# EAGLE design videopac_cart_V1.1 display addonbrd (EAGLE 7.5.0)
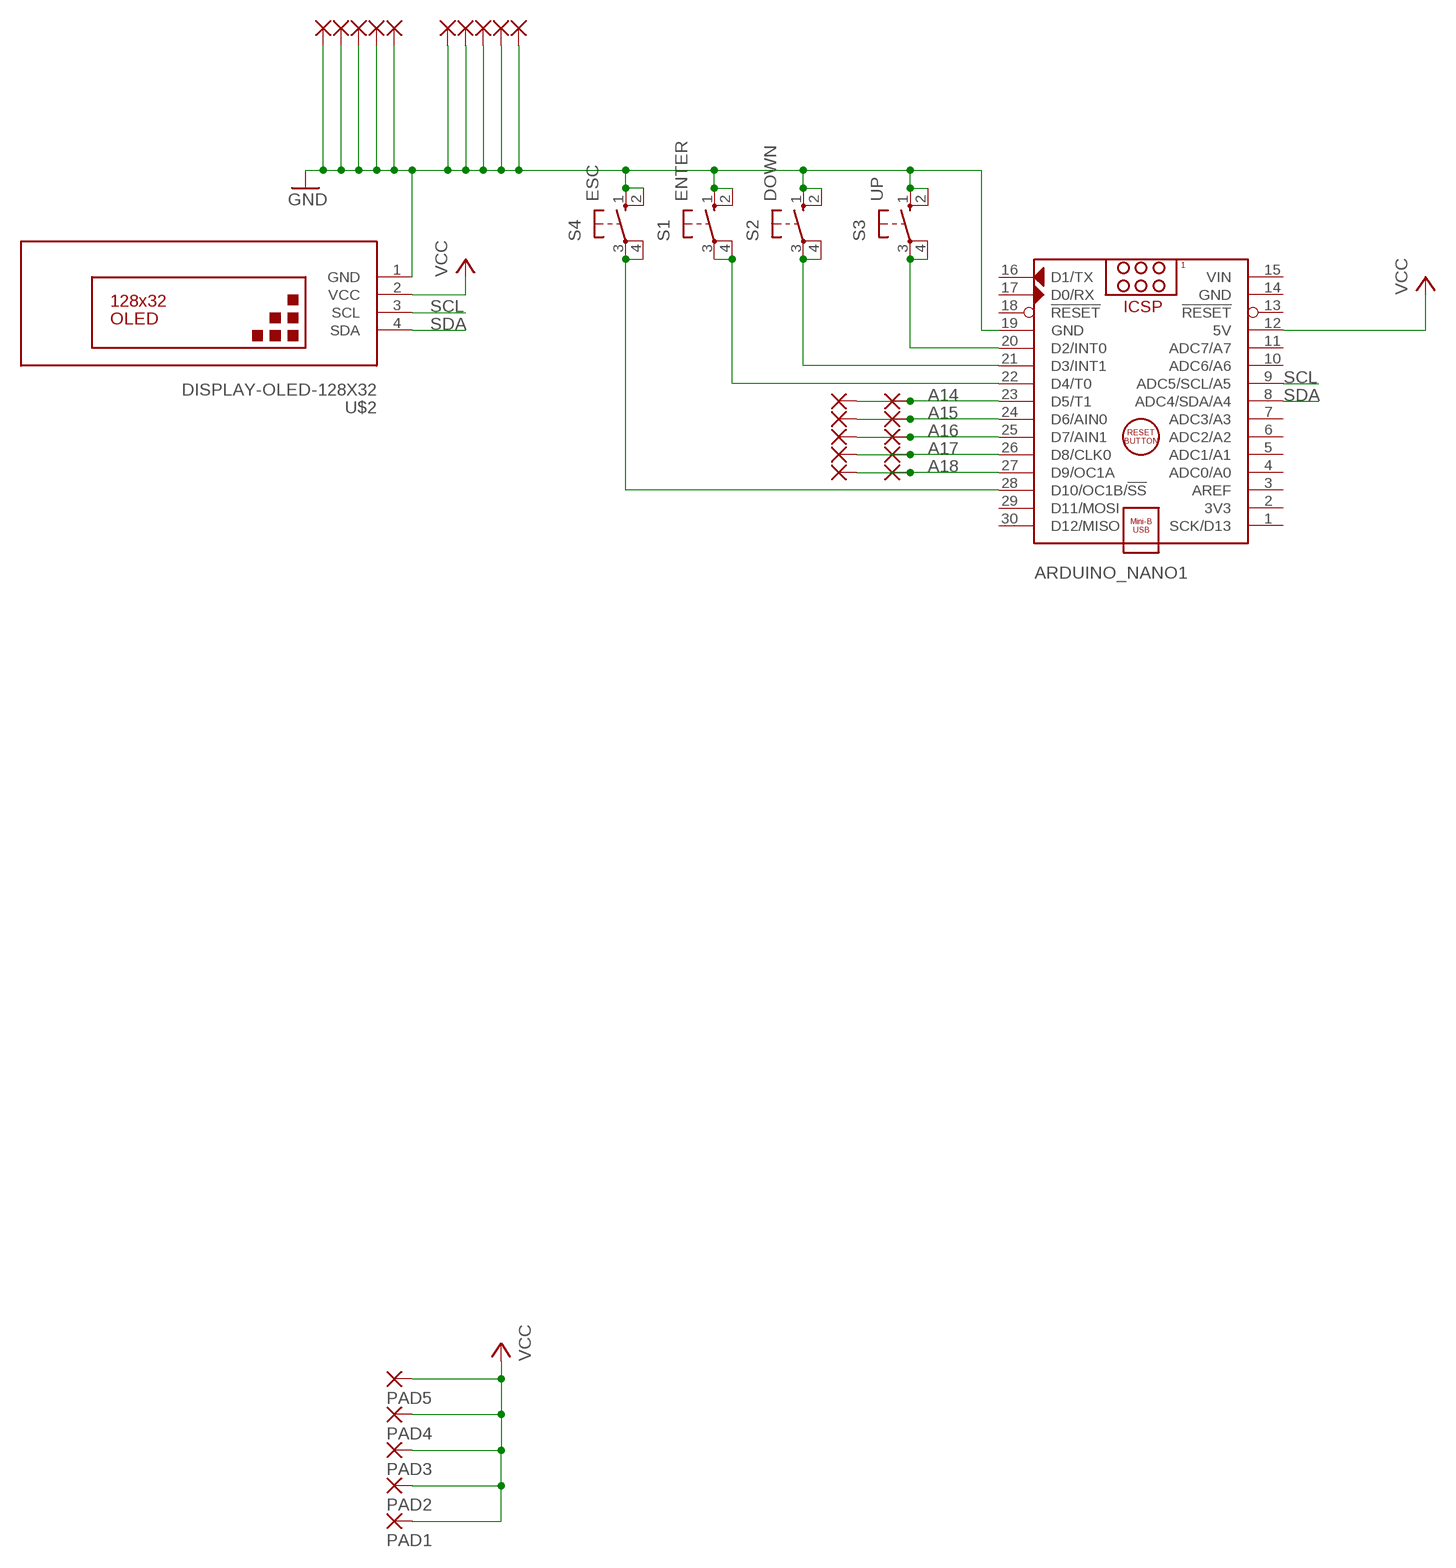
[diagram p0: schematic, sheet 1]

## Parts
ARDUINO_NANO1  ARDUINO_NANO  [ARDUINO_NANO]
PAD1  1,6/0,9  [1,6/0,9]
PAD2  1,6/0,9  [1,6/0,9]
PAD3  1,6/0,9  [1,6/0,9]
PAD4  1,6/0,9  [1,6/0,9]
PAD5  1,6/0,9  [1,6/0,9]
PAD6  1,6/0,9  [1,6/0,9]
PAD7  1,6/0,9  [1,6/0,9]
PAD8  1,6/0,9  [1,6/0,9]
PAD9  1,6/0,9  [1,6/0,9]
PAD10  1,6/0,9  [1,6/0,9]
PAD11  1,6/0,9  [1,6/0,9]
PAD12  1,6/0,9  [1,6/0,9]
PAD13  1,6/0,9  [1,6/0,9]
PAD14  1,6/0,9  [1,6/0,9]
PAD15  1,6/0,9  [1,6/0,9]
PAD16  1,6/0,9  [1,6/0,9]
PAD17  1,6/0,9  [1,6/0,9]
PAD18  1,6/0,9  [1,6/0,9]
PAD19  1,6/0,9  [1,6/0,9]
PAD20  1,6/0,9  [1,6/0,9]
PAD21  1,6/0,9  [1,6/0,9]
PAD22  1,6/0,9  [1,6/0,9]
PAD23  1,6/0,9  [1,6/0,9]
PAD24  1,6/0,9  [1,6/0,9]
PAD25  1,6/0,9  [1,6/0,9]
S1  ENTER  10-XX  [B3F-10XX]
S2  DOWN  10-XX  [B3F-10XX]
S3  UP  10-XX  [B3F-10XX]
S4  ESC  10-XX  [B3F-10XX]
U$2  DISPLAY-OLED-128X32  [DISPLAY-OLED-128X32]

## Nets
A14: ARDUINO_NANO1.23(D5/T1) PAD6.1(P) PAD11.1(P)
A15: ARDUINO_NANO1.24(D6/AIN0) PAD7.1(P) PAD12.1(P)
A16: ARDUINO_NANO1.25(D7/AIN1) PAD8.1(P) PAD13.1(P)
A17: ARDUINO_NANO1.26(D8/CLK0) PAD9.1(P) PAD14.1(P)
A18: ARDUINO_NANO1.27(D9/OC1A) PAD10.1(P) PAD15.1(P)
GND [power]: ARDUINO_NANO1.19(GND) PAD16.1(P) PAD17.1(P) PAD18.1(P) PAD19.1(P) PAD20.1(P) PAD21.1(P) PAD22.1(P) PAD23.1(P) PAD24.1(P) PAD25.1(P) S1.1(S) S1.2(S1) S2.1(S) S2.2(S1) S3.1(S) S3.2(S1) S4.1(S) S4.2(S1) U$2.1(GND)
N$1: ARDUINO_NANO1.28(D10/OC1B/!SS) S4.3(P) S4.4(P1)
N$31: ARDUINO_NANO1.20(D2/INT0) S3.3(P) S3.4(P1)
N$32: ARDUINO_NANO1.21(D3/INT1) S2.3(P) S2.4(P1)
N$33: ARDUINO_NANO1.22(D4/T0) S1.3(P) S1.4(P1)
SCL: ARDUINO_NANO1.9(ADC5/SCL/A5) U$2.3(SCL)
SDA: ARDUINO_NANO1.8(ADC4/SDA/A4) U$2.4(SDA)
VCC [power]: ARDUINO_NANO1.12(5V) PAD1.1(P) PAD2.1(P) PAD3.1(P) PAD4.1(P) PAD5.1(P) U$2.2(VCC)
Unconnected: ARDUINO_NANO1.1(SCK/D13) ARDUINO_NANO1.2(3V3) ARDUINO_NANO1.3(AREF) ARDUINO_NANO1.4(ADC0/A0) ARDUINO_NANO1.5(ADC1/A1) ARDUINO_NANO1.6(ADC2/A2) ARDUINO_NANO1.7(ADC3/A3) ARDUINO_NANO1.10(ADC6/A6) ARDUINO_NANO1.11(ADC7/A7) ARDUINO_NANO1.13(!RESET) ARDUINO_NANO1.16(D1/TX) ARDUINO_NANO1.17(D0/RX) ARDUINO_NANO1.18(!RESET) ARDUINO_NANO1.29(D11/MOSI) ARDUINO_NANO1.30(D12/MISO)

## Power pins joined to a net without a drawn wire
GND: ARDUINO_NANO1.14(GND)
VIN: ARDUINO_NANO1.15(VIN)

## Library data of the parts
ARDUINO_NANO1 = ArduinoNanoV30:ARDUINO_NANO: Arduino Nano V3.0 Module Overview: The Arduino Nano is a small, complete, and breadboard-friendly board based on the ATmega328 (Arduino Nano 3.x) or ATmega168 (Arduino Nano 2.x). It has more or less the same functionality of the Arduino Duemilanove, but in a different package. It lacks only a DC power jack, and works with a Mini-B USB cable instead of a standard one. The Nano was designed and is being produced by Gravitech <http://www.gravitech.us/arna30wiatp.html>. General specifications: Item Value Microcontroller Atmel ATmega168 or ATmega328 Operating Voltage (logic level) 5 V Input Voltage (recommended) 7-12 V Input Voltage (limits) 6-20 V Digital I/O Pins 14 (of which 6 provide PWM output) Analog Input Pins 8 DC Current per I/O Pin 40 mA Flash Memory 16 KB (ATmega168) or 32 KB (ATmega328) of which 2 KB used by bootloader SRAM 1 KB (ATmega168) or 2 KB (ATmega328) EEPROM 512 bytes (ATmega168) or 1 KB (ATmega328) Clock Speed 16 MHz Dimensions (Inches) 0.73" x 1.70" Dimensions (mm) 18mm x 45mm Overall height About 9 mm (not including pins) Weigth 5 g Power: The Arduino Nano can be powered via the Mini-B USB connection, 6-20V unregulated external power supply (pin 30), or 5V regulated external power supply (pin 27). The power source is automatically selected to the highest voltage source. Memory: The ATmega168 has 16 KB of flash memory for storing code (of which 2 KB is used for the bootloader); the ATmega328 has 32 KB, (also with 2 KB used for the bootloader). The ATmega168 has 1 KB of SRAM and 512 bytes of EEPROM (which can be read and written with the EEPROM library); the ATmega328 has 2 KB of SRAM and 1 KB of EEPROM. Input and Output: Each of the 14 digital pins on the Nano can be used as an input or output, using pinMode(), digitalWrite(), and digitalRead() functions. They operate at 5 volts. Each pin can provide or receive a maximum of 40 mA and has an internal pull-up resistor (disconnected by default) of 20-50 kOhms. In addition, some pins have specialized functions. Visit Arduino - ArduinoBoardNano <https://www.arduino.cc/en/Main/ArduinoBoardNano>
PAD1-PAD25 = wirepad:1,6/0,9: THROUGH-HOLE PAD
S1-S4 = switch-omron:10-XX: OMRON SWITCH; MPN: B3F-1000; OC_FARNELL: 176432; OC_NEWARK: 36M3542
U$2 = diy-modules:DISPLAY-OLED-128X32: 128x32 Dot Matrix OLED Module with I2C interface based on SSD1306 chip More details available here: http://www.tinyosshop.com/index.php?route=product/product&product_id=953 Schematic available here: http://www.tinyosshop.com/datasheet/OLED%2012832.pdf SSD1306 datasheet: https://cdn-shop.adafruit.com/datasheets/SSD1306.pdf Click here to find device on ebay.com <http://www.ebay.com/sch/oled+display+128x32+i2c>

## Net classes
0 default: width 0.406 mm
1 power: width 0.61 mm

## Board
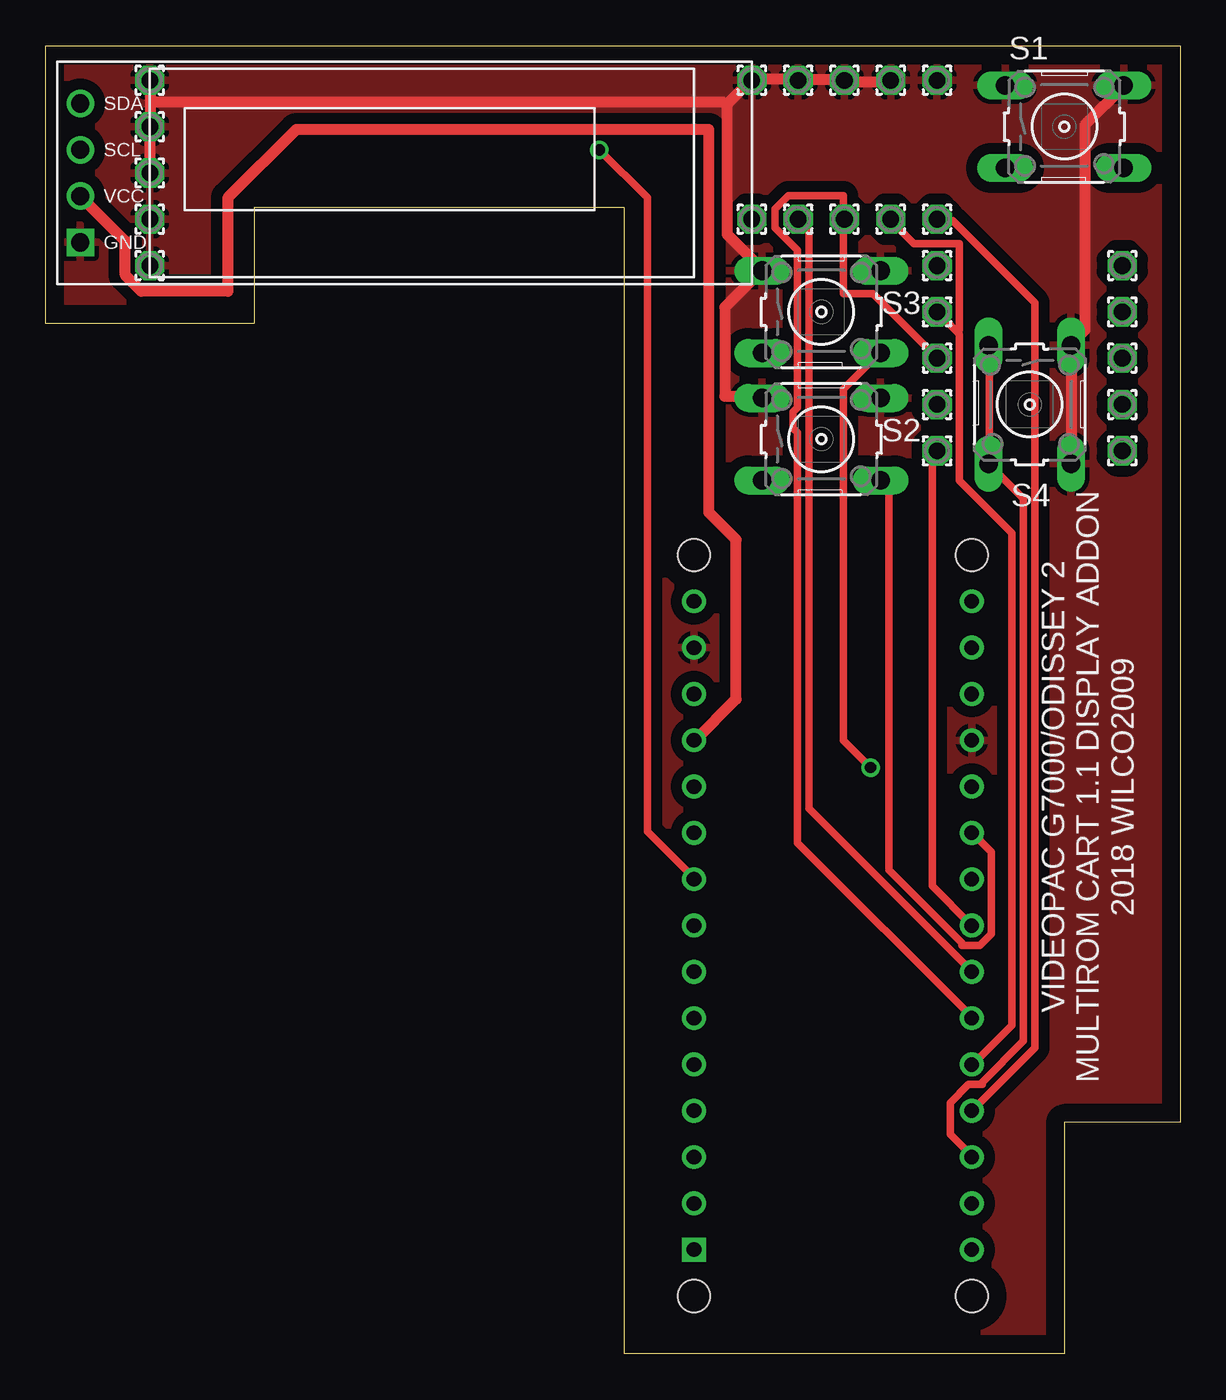
[diagram p1: board, top side]
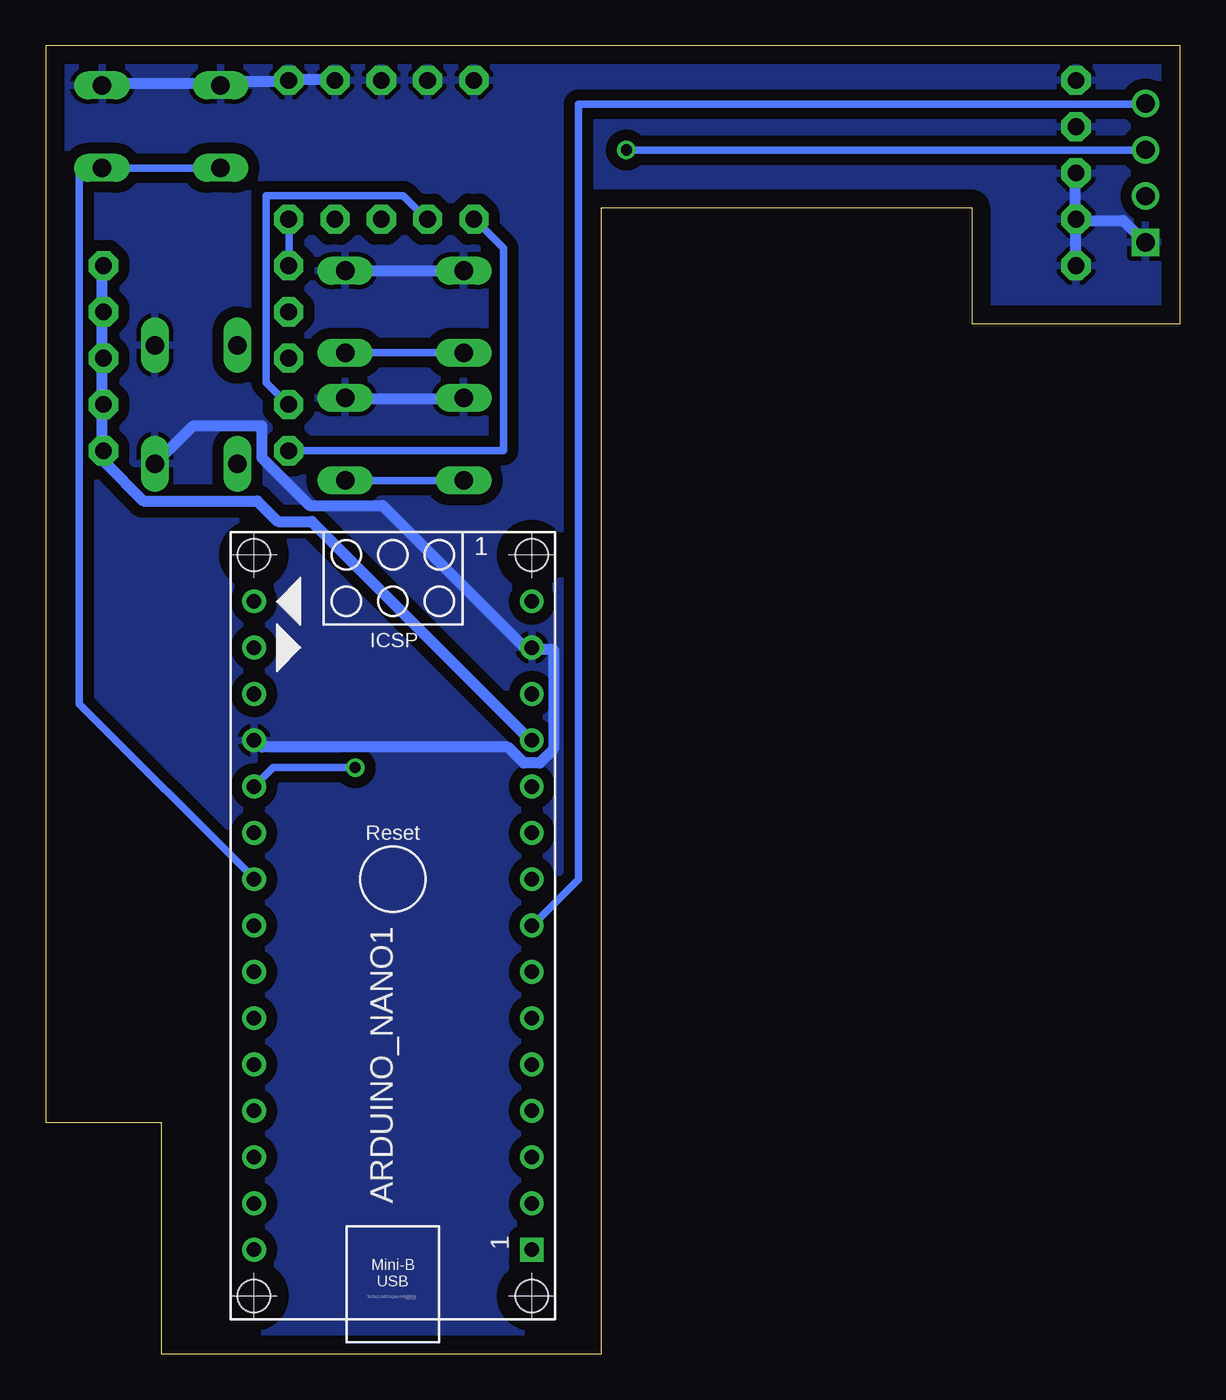
[diagram p2: board, bottom side, seen from below]

Size 62.23 x 71.75 mm. Coordinates in mm from the lower left corner, seen from the top.
Outline: 0,71.75 62.23,71.75 62.23,12.7 55.88,12.7 55.88,0 31.75,0 31.75,62.86 11.43,62.86 11.43,56.52 0,56.52 0,71.75
Copper layers (1*16): Top 0.035mm / dielectric 1.5mm / Bottom 0.035mm
Design rules "default *": minimum track width 16mil, minimum drill 24mil, track to track 8mil, track to pad 8mil, pad to pad 8mil, via to via 8mil, smd to smd 8mil, copper to edge 40mil, drill to drill 8mil, minimum pad ring 10mil, minimum via ring 8mil, stop-mask expansion 4mil, vias tented up to drill 0mil, thermal gap 10mil

### Footprints (pad centres in the part's own frame; a part is rotated, then mirrored left to right if it is on the bottom)
ARDUINO_NANO = drill 0.8 square: 1 -20.32,-7.62 | drill 0.8: 2 -17.78,-7.62; 3 -15.24,-7.62; 4 -12.7,-7.62; 5 -10.16,-7.62; 6 -7.62,-7.62; 7 -5.08,-7.62; 8 -2.54,-7.62; 9 0,-7.62; 10 2.54,-7.62; 11 5.08,-7.62; 12 7.62,-7.62; 13 10.16,-7.62; 14 12.7,-7.62; 15 15.24,-7.62; 16 15.24,7.62; 17 12.7,7.62; 18 10.16,7.62; 19 7.62,7.62; 20 5.08,7.62; 21 2.54,7.62; 22 0,7.62; 23 -2.54,7.62; 24 -5.08,7.62; 25 -7.62,7.62; 26 -10.16,7.62; 27 -12.7,7.62; 28 -15.24,7.62; 29 -17.78,7.62; 30 -20.32,7.62 | hole 1.778: -22.86,-7.62; -22.86,7.62; 17.78,7.62; 17.78,-7.62
1,6/0,9 = drill 0.914 pad 1.6 octagon: 1 0,0
B3F-10XX = drill 1.016 long: 1 -3.251,2.261; 2 3.251,2.261; 3 -3.251,-2.261; 4 3.251,-2.261
DISPLAY-OLED-128X32 = drill 1 square: 1 -17.78,-3.81 | drill 1: 2 -17.78,-1.27; 3 -17.78,1.27; 4 -17.78,3.81

### Placement (x,y rotation side)
ARDUINO_NANO1  43.18,26.04 90 bottom
PAD1  59.05,59.69 0 top
PAD2  59.05,57.15 0 top
PAD3  59.05,54.61 0 top
PAD4  59.05,52.07 0 top
PAD5  59.05,49.53 0 top
PAD6  48.9,49.53 0 top
PAD7  48.9,52.07 0 top
PAD8  48.9,54.61 0 top
PAD9  48.9,57.15 0 top
PAD10  48.9,59.69 0 top
PAD11  38.73,62.23 0 top
PAD12  41.27,62.23 0 top
PAD13  43.81,62.23 0 top
PAD14  46.35,62.23 0 top
PAD15  48.9,62.23 0 top
PAD16  38.73,69.85 0 top
PAD17  41.27,69.85 0 top
PAD18  43.81,69.85 0 top
PAD19  46.35,69.85 0 top
PAD20  48.9,69.85 0 top
PAD21  5.71,69.85 0 top
PAD22  5.71,67.31 0 top
PAD23  5.71,64.77 0 top
PAD24  5.71,62.23 0 top
PAD25  5.71,59.69 0 top
S1  55.88,67.31 0 top
S2  42.55,50.17 0 top
S3  42.55,57.15 0 top
S4  53.98,52.07 270 top
U$2  19.68,64.77 0 top

### Tracks (layer width: path | path; a pad name or v marks a point on that pad's centre or on a via)
A14
  Top 0.406: ARDUINO_NANO1.23 50.75,23.53 48.62,25.66 48.62,49.28 48.88,49.53 PAD6.1
  Bottom 0.406: PAD6.1 37.12,49.53 37.12,60.66 38.62,62.16 PAD11.1
A15
  Top 0.406: ARDUINO_NANO1.24 50.75,21.03 41.88,29.91 41.88,61.66 41.38,62.16 PAD12.1
  Bottom 0.406: PAD7.1 49,52.16 50.12,53.28 50.12,63.53 42.62,63.53 41.38,62.28 PAD12.1
A16
  Top 0.406: ARDUINO_NANO1.25 50.75,18.53 41.25,28.03 41.25,50.53 41,50.78 41,51.66 41.25,51.91 41.25,60.53 40,61.78 40,62.78 40.75,63.53 43.75,63.53 43.75,62.28 PAD13.1 43.75,62.03 43.75,58.16 45.38,58.16 48.88,54.66 PAD8.1
A17
  Top 0.406: 50,56.03 49,57.03 PAD9.1 | 50,56.03 50.12,55.91 50.12,47.91 53,45.03 53,18.03 50.88,15.9 ARDUINO_NANO1.26 | PAD14.1 46.38,62.16 47.62,60.91 50.12,60.91 50.12,56.16 50,56.03
A18
  Top 0.406: ARDUINO_NANO1.27 50.88,13.4 54.25,16.78 54.25,57.66 49.75,62.16 49,62.16 PAD15.1
  Bottom 0.406: PAD10.1 48.88,59.78 48.88,62.16 PAD15.1
GND
  Top 0.61: 5.75,68.66 5.75,69.78 PAD21.1 | 5.75,68.66 5.75,67.41 PAD22.1 5.75,67.03 5.75,64.78 PAD23.1 | S2.1 39.25,52.53 37.25,52.53 37.25,57.41 39.25,59.41 S3.1 39.12,59.66 37.38,61.41 37.38,68.53 | PAD19.1 46.25,69.78 44.12,69.78 PAD18.1 43.75,69.91 41.5,69.91 PAD17.1 41.25,69.91 38.75,69.91 PAD16.1 38.5,69.66 37.38,68.53 | S4.2 56.25,48.91 56.25,55.28 S4.1 56.38,55.53 57,56.16 57,67.41 59.12,69.53 S1.2 | 5.75,68.66 37.12,68.66 37.38,68.53
  Bottom 0.61: ARDUINO_NANO1.19 50.75,33.66 50.38,33.28 36.88,33.28 36,32.41 35.12,32.41 34.38,33.16 34.38,38.66 35.5,38.66 ARDUINO_NANO1.14 35.88,38.66 43.75,46.53 47.75,46.53 50.38,49.16 50.38,50.91 54.12,50.91 56.12,48.91 S4.2 | U$2.1 2,61.03 3.12,62.16 5.62,62.16 PAD24.1 | PAD25.1 5.75,59.78 5.75,61.91 PAD24.1 | PAD23.1 5.75,64.66 5.75,62.53 PAD24.1 | S2.1 39.38,52.41 45.75,52.41 S2.2 | S3.1 39.38,59.41 45.75,59.41 S3.2 | S1.2 59.12,69.66 52.88,69.66 S1.1 52.62,69.66 52.5,69.78 49,69.78 PAD20.1 48.62,69.91 46.38,69.91 PAD19.1
  pour Top (isolate 0.61): 0,71.75 62.23,71.75 62.23,0 0,0
  pour Bottom (isolate 0.61): 0,71.75 62.23,71.75 62.23,0 0,0
N$1
  Top 0.406: ARDUINO_NANO1.28 50.75,10.9 49.62,12.03 49.62,13.78 50.62,14.78 51.38,14.78 51.38,14.9 53.62,17.16 53.62,46.91 51.75,48.78 S4.4 51.75,48.91 51.75,55.28 S4.3
N$31  (via drill 0.61)
  Top 0.406: v45.25,32.16 43.75,33.66 43.75,52.91 45.75,54.91 S3.4
  Bottom 0.406: v45.25,32.16 49.75,32.16 50.75,31.16 ARDUINO_NANO1.20 | S3.3 39.38,54.91 45.75,54.91 S3.4
N$32
  Top 0.406: ARDUINO_NANO1.21 50.88,28.53 51.88,27.53 51.88,23.03 51.25,22.41 50.25,22.41 50.25,22.53 46.25,26.53 46.25,47.41 45.88,47.78 S2.4
  Bottom 0.406: S2.3 39.38,47.91 45.75,47.91 S2.4
N$33
  Bottom 0.406: ARDUINO_NANO1.22 50.88,26.16 60.38,35.66 60.38,65.03 59.25,65.03 S1.4 59,65.03 52.75,65.03 S1.3
SCL  (via drill 0.61)
  Top 0.406: v30.38,66.03 33,63.41 33,28.66 35.5,26.16 ARDUINO_NANO1.9
  Bottom 0.406: v30.38,66.03 2,66.03 U$2.3
SDA
  Bottom 0.406: ARDUINO_NANO1.8 35.5,23.53 33,26.03 33,68.53 2,68.53 U$2.4
VCC
  Top 0.61: U$2.2 4.38,61.03 4.38,59.16 5.25,58.28 10,58.28 10,63.41 13.75,67.16 36.38,67.16 36.38,46.16 37.88,44.66 37.88,35.91 35.62,33.66 ARDUINO_NANO1.12
  Bottom 0.61: ARDUINO_NANO1.12 35.62,33.66 47.62,45.66 49.5,45.66 50.62,46.78 56.88,46.78 59,48.91 59,49.53 PAD5.1 59.12,49.78 59.12,52.03 PAD4.1 59.12,52.28 59.12,54.53 PAD3.1 59.12,54.91 59.12,57.03 PAD2.1 59.12,57.41 59.12,59.66 PAD1.1

### Text on the board
tPlace: VIDEOPAC G7000/ODISSEY 2 / MULTIROM CART 1.1 DISPLAY ADDON / 2018 WILCO2009